# Altium project NixieClock_v010.PrjPcb
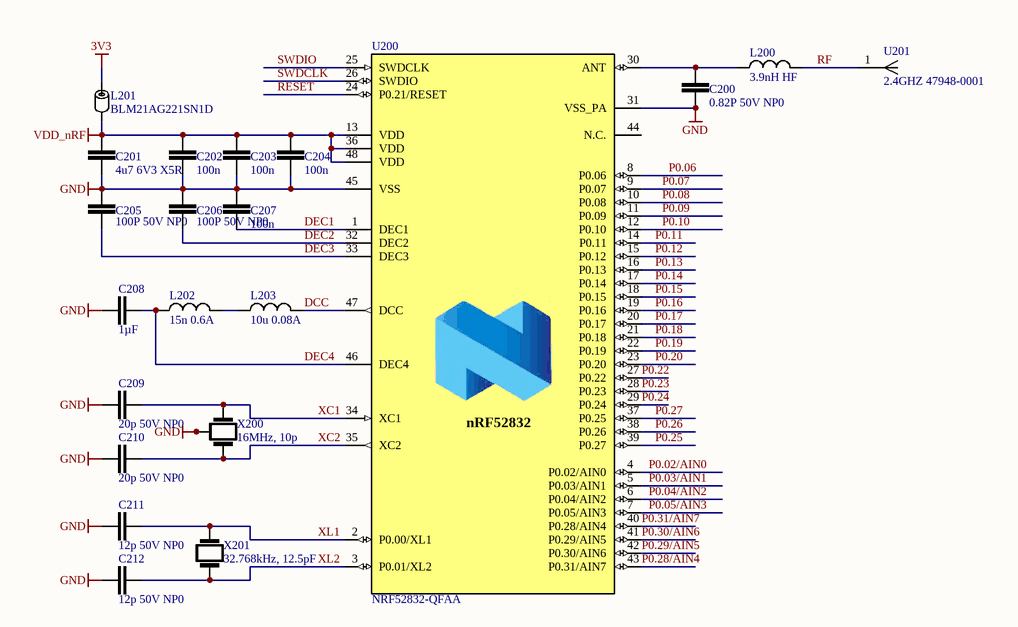
[diagram p0: MCU_nRF82532.SchDoc]
4 sheets, 83 parts. Net scope: hierarchical (ports join the sheet entries above them; power ports are global).
Sheets:
  MCU_nRF82532.SchDoc
  Misc.SchDoc
  Hierarchy.SchDoc
    Display Driver = DisplayDriver.SchDoc

## Sheet MCU_nRF82532.SchDoc
size A4

### Parts
C200  0.82P 50V NP0  [CAPC1608N]
C201  4u7 6V3 X5R  [CAPC2012N]
C202  100n  [CAPC2012N]
C203  100n  [CAPC2012N]
C204  100n  [CAPC2012N]
C205  100P 50V NP0  [CAPC2012N]
C206  100P 50V NP0  [CAPC2012N]
C207  100n  [CAPC2012N]
C208  1µF  [CAPC2012N]
C209  20p 50V NP0  [CAPC2012N]
C210  20p 50V NP0  [CAPC2012N]
C211  12p 50V NP0  [CAPC2012N]
C212  12p 50V NP0  [CAPC2012N]
L200  3.9nH HF  [INDC2009N]
L201  BLM21AG221SN1D  [INDC2009N]
L202  15n 0.6A  [INDP6060X32N]
L203  10u 0.08A  [INDC2009N]
U200  NRF52832-QFAA  [QFN40P600X600X90-48N]
U201  2.4GHZ 47948-0001  [RF_ANT_CHIP_2.4GHZ_47948-0001]
X200  16MHz, 10p  [SMD3225]
X201  32.768kHz, 12.5pF  [ABS06]

### Nets
3V3: L201.1
GND: C200.1 C201.1 C202.2 C203.2 C204.2 C205.2 C206.2 C207.2 C208.1 C209.1 C210.1 C211.2 C212.2 U200.31(VSS_PA) U200.45(VSS) X200.2(GND) X200.4(GND)
VDD_nRF: C201.2 C202.1 C203.1 C204.1 L201.2 U200.13(VDD) U200.36(VDD) U200.48(VDD)
DCC: L203.2 U200.47(DCC)
DEC1: C207.1 U200.1(DEC1)
DEC2: C206.1 U200.32(DEC2)
DEC3: C205.1 U200.33(DEC3)
DEC4: C208.2 L202.1 U200.46(DEC4)
P0.02/AIN0: U200.4(P0.02/AIN0)
P0.03/AIN1: U200.5(P0.03/AIN1)
P0.04/AIN2: U200.6(P0.04/AIN2)
P0.05/AIN3: U200.7(P0.05/AIN3)
P0.06: U200.8(P0.06)
P0.07: U200.9(P0.07)
P0.08: U200.10(P0.08)
P0.09: U200.11(P0.09)
P0.10: U200.12(P0.10)
P0.11: U200.14(P0.11)
P0.12: U200.15(P0.12)
P0.13: U200.16(P0.13)
P0.14: U200.17(P0.14)
P0.15: U200.18(P0.15)
P0.16: U200.19(P0.16)
P0.17: U200.20(P0.17)
P0.18: U200.21(P0.18)
P0.19: U200.22(P0.19)
P0.20: U200.23(P0.20)
P0.22: U200.27(P0.22)
P0.23: U200.28(P0.23)
P0.24: U200.29(P0.24)
P0.25: U200.39(P0.27)
P0.26: U200.38(P0.26)
P0.27: U200.37(P0.25)
P0.28/AIN4: U200.43(P0.31/AIN7)
P0.29/AIN5: U200.42(P0.30/AIN6)
P0.30/AIN6: U200.41(P0.29/AIN5)
P0.31/AIN7: U200.40(P0.28/AIN4)
RESET: U200.24(P0.21/RESET)
RF: L200.2 U201.1(FT)
SWDCLK: U200.26(SWDIO)
SWDIO: U200.25(SWDCLK)
XC1: C209.2 U200.34(XC1) X200.1
XC2: C210.2 U200.35(XC2) X200.3
XL1: C211.1 U200.2(P0.00/XL1) X201.2
XL2: C212.1 U200.3(P0.01/XL2) X201.1
NetC200_2: C200.2 L200.1 U200.30(ANT)
NetL202_2: L202.2 L203.1

Not connected (* = marked no-connect by the designer): U200 44(N.C.)

### Notes on the sheet
- (in symbol IC MCU nRF52832_QFAA ARM M0 BLUETOOTH) nRF52832

### Library data of the parts
C200 = CAP 1608 0.82P 50V 5% NP0: YAGEO (PHYCOMP) - CC0603CRNPO9BNR82 - CAP, MLCC, C0G/NP0, 0.82PF, 50V, 0603; Initial Voltage: 0; Supplier 1: Farnell; Supplier Part Number 1: 721839; Manufacturer Part Number: CC0603CRNPO9BNR82; Manufacturer: YAGEO (PHYCOMP); Value: 0.82P
C201 = CAP 2012 4U7F 6.3V 10% X5R: KEMET - C0805C475K9PACTU - CAP, MLCC, X5R, 4.7UF, 6.3V, 0805; Initial Voltage: 0; Capacitance Tolerance: ± 10%; Value: 4.7; Voltage Rating: 6.3; Package / Case: 0805 (2012 Metric); Supplier 1: Farnell; Supplier Part Number 1: 9227857; Manufacturer Part Number: C0805C475K9PACTU; Manufacturer: KEMET; Operating Temperature Range: -55°C to +85
C202-C204 C207 = CAP 2012 100N 25V 10% X7R: Ceramic Capacitor; Surface-Mount; Manufacturer: WALSIN; Manufacturer Part Number: 0805B104K250CT; Tolerance: ± 10%; Rating: 25V; Dielectric Characteristic: X7R; Initial Voltage: 0; Value: 100n; Supplier 1: Farnell; Supplier Part Number 1: 2496943
C205 C206 = CAP 2012 100P 50V 10% NP0: KEMET - C0805C101J5GACTU - CAP, MLCC, C0G/NP0, 100PF, 50V, 0805; Initial Voltage: 0; Package / Case: 0805 (2012 Metric); Supplier 1: Farnell; Supplier Part Number 1: 1414656; Manufacturer: KEMET; Manufacturer Part Number: C0805C101J5GACTU; Value: 100P
C208 = CAP 2012 1U 25V 10% X7R: CAP CER 1UF 25V X7R 0805; Manufacturer Part Number: GRM21BR71E105KA99L; Manufacturer: Murata Electronics North America; Initial Voltage: 0; Value: 1µF; Supplier 1: Digi-Key; Supplier Part Number 1: 490-6484-1-ND; Package / Case: 0805 (2012 Metric)
C209 C210 = CAP 2012 20P 50V 10% NP0: CAP CER 22PF 50V NP0 0805; Manufacturer Part Number: C0805C200J5GACTU; Manufacturer: KEMET; Initial Voltage: 0; Voltage Rating: 50; Dielectric Characteristic: C0G / NP0; Tolerance: 5%; Package / Case: 0805 (2012 Metric); Value: 20p; Supplier 1: Farnell; Supplier Part Number 1: 2581087
C211 C212 = CAP 2012 12P 50V 10% NP0: WALSIN - 0805N120J500CT - CAPACITOR, MLCC, NP0, 12PF, 50V, 0805; Initial Voltage: 0; Value: 22pF; Dielectric Characteristic: C0G / NP0; Package / Case: 0805 (2012 Metric); Supplier 1: Farnell; Supplier Part Number 1: 2497013; Manufacturer: WALSIN; Manufacturer Part Number: 0805N120J500CT
L200 = IND 2012 3.9N 5% HF: COILCRAFT - 0805HT-3N9TJLB - INDUCTOR, RF, 3.9NH, 5%, 6.1GHZ, SMD; Inductance: 3.9; High Frequency Inductor Case: 0805 [2012 Metric]; Self Resonant Frequency Min: 6.1; Supplier 1: Farnell; Supplier Part Number 1: 2286484; Inductance Tolerance: ± 5%; Manufacturer Part Number: 0805HT-3N9TJLB; Manufacturer: COILCRAFT
L201 = IND 2012 FERRITE 220R @ 100MHz: MURATA - BLM21AG221SN1D - FERRITE BEAD, 0.13OHM, 800MA, 0805; Initial Current: 0; DC Current Rating: 200; DC Resistance Max: 0.13; Ferrite Case Style: 0805 [2012 Metric]; Impedance @ 100MHz: 220; Manufacturer: MURATA; Supplier 1: Farnell; Operating Temperature Min: -55; Operating Temperature Max: +125; Manufacturer Part Number: BLM21AG221SN1D; Supplier Part Number 1: 1515619
L202 = IND 2012 15N 0.6A 5%: VISHAY - IMC0805ER15NJ01 - HF INDUCTOR, 15NH, 600MA, 5% 3.6GHZ; DC Resistance Max: 0.08; Inductance: 15; Tolerance: 5%; Value: 15n; Supplier 1: Farnell; Manufacturer Part Number: IMC0805ER15NJ01; Manufacturer: VISHAY; Supplier Part Number 1: 1189465
L203 = IND 2012 10U 0.08A 5%: ISHAY - IMC0805ER100J01 - INDUCTOR, WIREWOUND, HIGH F; Manufacturer: VISHAY; Tolerance: 5%; Value: 10u; Supplier 1: Farnell; Supplier Part Number 1: 1653752; Manufacturer Part Number: IMC0805ER100J01
U200 = IC MCU nRF52832_QFAA ARM M0 BLUETOOTH: Multi-protocol Bluetooth Low Energy, ANT and 2.4GHz proprietary system-on-chip; Part number IPS: N.A.; Manufacturer: Nordic Semiconductor ASA; Manufacturer Part Number: NRF52832-QFAA-R; Memory Size: 512kB Flash, 64kB RAM; Voltage - Supply: 1.7 V ~ 3.6 V; Pin Count: 54; Supplier 1: Digi-Key; Package / Case: 48-VFQFN Exposed Pad; Category: RF/IF and RFID; Operating Temperature: -40°C ~ 85°C; Frequency: 2.4GHz; Supplier Part Number 1: 1490-1052-6-ND
U201 = RF ANT CHIP 2.4GHZ 47948-0001
X200 = XTAL SMD 16MHz 10P 20ppm: ABRACON - ABM10-16.000MHZ-D30-T3 - CRYSTAL, 16MHZ, 10PF, 2.5 X 2MM; Crystal Case: SMD, 2.5mm x 2; Load Capacitance: 10; Frequency Nom: 16; Supplier 1: Farnell; Operating Temperature Max: 85; Manufacturer: ABRACON; Operating Temperature Min: -40; Manufacturer Part Number: ABM10-16.000MHZ-D30-T3; value: 16MHz; Supplier Part Number 1: 2467762
X201 = XTAL SMD 32.768K 12.5P 20PPM: ABRACON - ABS06-32.768KHZ-T - CRYSTAL, 32.768KHZ, 12.5PF, SMD; Crystal Case: SMD, 2mm x 1.2; Frequency: 32.768; Supplier 1: Farnell; Manufacturer Part Number: ABS06-32.768KHZ-T; Operating Temperature Range: -40°C to +85; Manufacturer: ABRACON; value: 32.768kHz, 12.5pF; Supplier Part Number 1: 2101345

## Sheet Misc.SchDoc
size A4
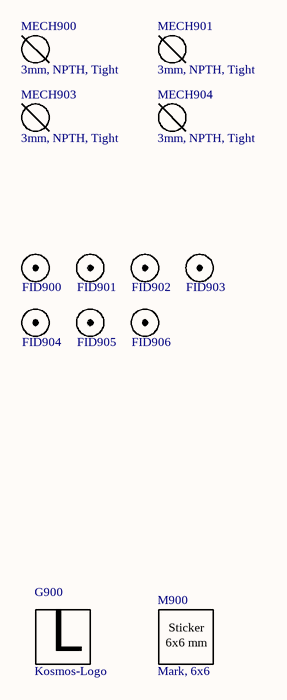
[diagram p1: Misc.SchDoc]

### Parts
FID900  FIDUCIAL ROUND 2,5MM  [FID100X300]  (value not drawn)  (no BOM)
FID901  FIDUCIAL ROUND 2,5MM  [FID100X300]  (value not drawn)  (no BOM)
FID902  FIDUCIAL ROUND 2,5MM  [FID100X300]  (value not drawn)  (no BOM)
FID903  FIDUCIAL ROUND 2,5MM  [FID100X300]  (value not drawn)  (no BOM)
FID904  FIDUCIAL ROUND 2,5MM  [FID100X300]  (value not drawn)  (no BOM)
FID905  FIDUCIAL ROUND 2,5MM  [FID100X300]  (value not drawn)  (no BOM)
FID906  FIDUCIAL ROUND 2,5MM  [FID100X300]  (value not drawn)  (no BOM)
G900  Kosmos-Logo  [KOSMOS_LOGO_S]  (no BOM)
M900  Mark, 6x6  [MARK_6X6_A]  (no BOM)
MECH900  3mm, NPTH, Tight  [MTGNP730H310P]  (no BOM)
MECH901  3mm, NPTH, Tight  [MTGNP730H310P]  (no BOM)
MECH903  3mm, NPTH, Tight  [MTGNP730H310P]  (no BOM)
MECH904  3mm, NPTH, Tight  [MTGNP730H310P]  (no BOM)

### Notes on the sheet
- (in symbol LOGO KOSMOS OVERLAY) L
- (in symbol STICKER MARK 6X6) Sticker; 6x6 mm

### Library data of the parts
FID900-FID906 = FIDUCIAL ROUND 2,5MM: Fiducial, Round, 1mm
G900 = LOGO KOSMOS OVERLAY: Kosmos-Logo-XL-Top-Overlay
M900 = STICKER MARK 6X6: Stick Mark, 6x6 mm,
MECH900 MECH901 MECH903 MECH904 = MH 3MM NPTH TIGHT: Mounting Hole, 3mm, Non-Plated, Tight-Fit

## Sheet Hierarchy.SchDoc
size A4
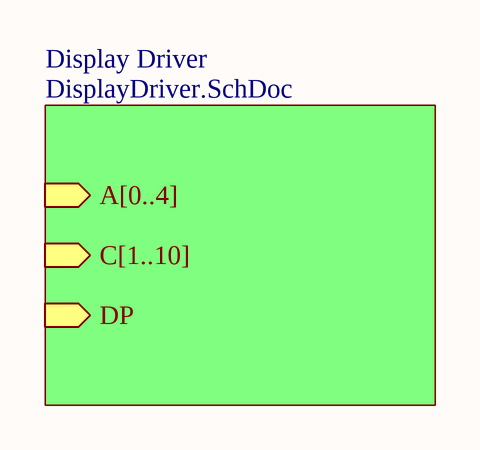
[diagram p2: Hierarchy.SchDoc]

### Sub-sheets
Display Driver = DisplayDriver.SchDoc: A[0..4] (in), C[1..10] (in), DP (in)

## Sheet DisplayDriver.SchDoc
size A4
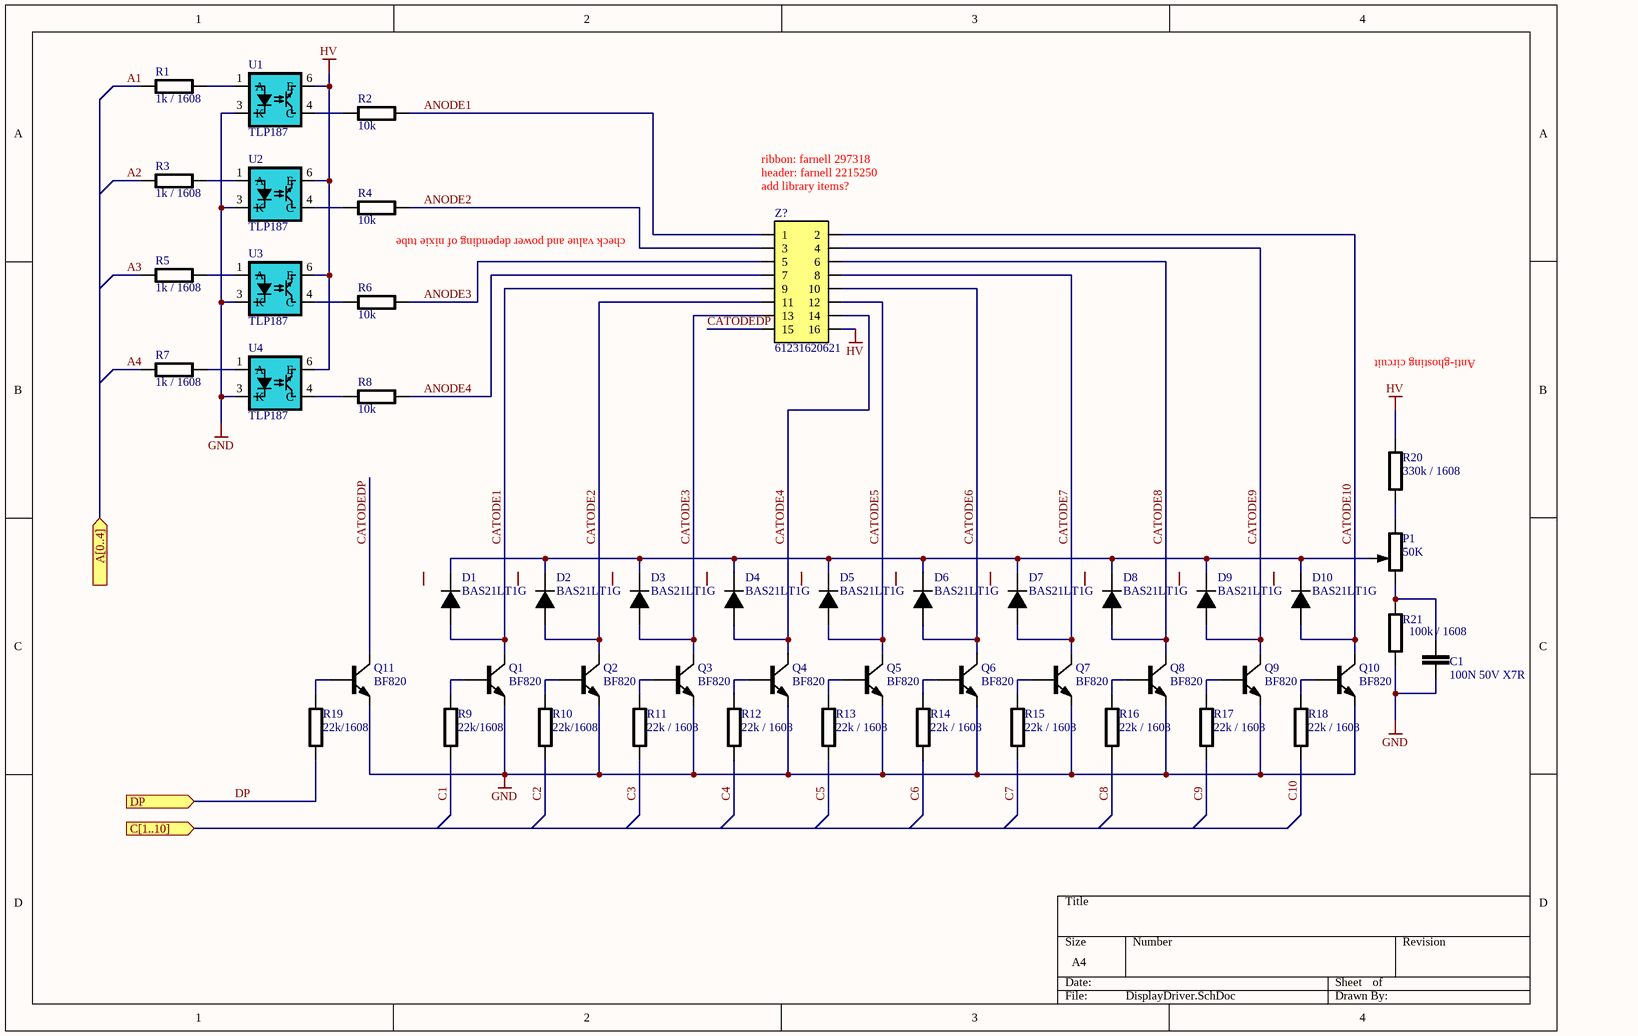
[diagram p3: DisplayDriver.SchDoc]

### Parts
C1  100N 50V X7R  [CAPC1608N]
D1  BAS21LT1G  [SOT95P230X124-3N]
D2  BAS21LT1G  [SOT95P230X124-3N]
D3  BAS21LT1G  [SOT95P230X124-3N]
D4  BAS21LT1G  [SOT95P230X124-3N]
D5  BAS21LT1G  [SOT95P230X124-3N]
D6  BAS21LT1G  [SOT95P230X124-3N]
D7  BAS21LT1G  [SOT95P230X124-3N]
D8  BAS21LT1G  [SOT95P230X124-3N]
D9  BAS21LT1G  [SOT95P230X124-3N]
D10  BAS21LT1G  [SOT95P230X124-3N]
P1  50K  [TRIM_3314J_BOURNS]
Q1  BF820  [SOT95P230X124-3N]
Q2  BF820  [SOT95P230X124-3N]
Q3  BF820  [SOT95P230X124-3N]
Q4  BF820  [SOT95P230X124-3N]
Q5  BF820  [SOT95P230X124-3N]
Q6  BF820  [SOT95P230X124-3N]
Q7  BF820  [SOT95P230X124-3N]
Q8  BF820  [SOT95P230X124-3N]
Q9  BF820  [SOT95P230X124-3N]
Q10  BF820  [SOT95P230X124-3N]
Q11  BF820  [SOT95P230X124-3N]
R1  1k / 1608  [RESC1608N]
R2  10k  [RESC2012N]
R3  1k / 1608  [RESC1608N]
R4  10k  [RESC2012N]
R5  1k / 1608  [RESC1608N]
R6  10k  [RESC2012N]
R7  1k / 1608  [RESC1608N]
R8  10k  [RESC2012N]
R9  22k/1608  [RESC1608N]
R10  22k/1608  [RESC1608N]
R11  22k / 1608  [RESC1608N]
R12  22k / 1608  [RESC1608N]
R13  22k / 1608  [RESC1608N]
R14  22k / 1608  [RESC1608N]
R15  22k / 1608  [RESC1608N]
R16  22k / 1608  [RESC1608N]
R17  22k / 1608  [RESC1608N]
R18  22k / 1608  [RESC1608N]
R19  22k/1608  [RESC1608N]
R20  330k / 1608  [RESC1608N]
R21  100k / 1608  [RESC1608N]
U1  TLP187  [SOP127P700X220-4_6N]
U2  TLP187  [SOP127P700X220-4_6N]
U3  TLP187  [SOP127P700X220-4_6N]
U4  TLP187  [SOP127P700X220-4_6N]
Z?  61231620621  [WE_61231620621]

### Ports
A[0..4] (in), C[1..10] (in), DP (in)

### Nets
GND: C1.2 Q1.2(E) Q2.2(E) Q3.2(E) Q4.2(E) Q5.2(E) Q6.2(E) Q7.2(E) Q8.2(E) Q9.2(E) Q10.2(E) Q11.2(E) R21.1 U1.3(K) U2.3(K) U3.3(K) U4.3(K)
HV: R20.1 U1.6(E) U2.6(E) U3.6(E) U4.6(E) Z?.16
A1: R1.1
A2: R3.1
A3: R5.2
A4: R7.1
ANODE1: R2.1 Z?.1
ANODE2: R4.1 Z?.3
ANODE3: R6.1 Z?.5
ANODE4: R8.1 Z?.7
C1: R9.2
C2: R10.1
C3: R11.2
C4: R12.2
C5: R13.2
C6: R14.1
C7: R15.2
C8: R16.2
C9: R17.2
C10: R18.1
CATODE1: D1.1(A) Q1.3(C) Z?.9
CATODE2: D2.1(A) Q2.3(C) Z?.11
CATODE3: D3.1(A) Q3.3(C) Z?.13
CATODE4: D4.1(A) Q4.3(C) Z?.14
CATODE5: D5.1(A) Q5.3(C) Z?.12
CATODE6: D6.1(A) Q6.3(C) Z?.10
CATODE7: D7.1(A) Q7.3(C) Z?.8
CATODE8: D8.1(A) Q8.3(C) Z?.6
CATODE9: D9.1(A) Q9.3(C) Z?.4
CATODE10: D10.1(A) Q10.3(C) Z?.2
CATODEDP: Q11.3(C) Z?.15
DP: R19.1 ; port DP
NetC1_1: C1.1 P1.1 R21.2
NetD1_3: D1.3(K) D2.3(K) D3.3(K) D4.3(K) D5.3(K) D6.3(K) D7.3(K) D8.3(K) D9.3(K) D10.3(K) P1.2
NetP1_3: P1.3 R20.2
NetQ1_1: Q1.1(B) R9.1
NetQ2_1: Q2.1(B) R10.2
NetQ3_1: Q3.1(B) R11.1
NetQ4_1: Q4.1(B) R12.1
NetQ5_1: Q5.1(B) R13.1
NetQ6_1: Q6.1(B) R14.2
NetQ7_1: Q7.1(B) R15.1
NetQ8_1: Q8.1(B) R16.1
NetQ9_1: Q9.1(B) R17.1
NetQ10_1: Q10.1(B) R18.2
NetQ11_1: Q11.1(B) R19.2
NetR1_2: R1.2 U1.1(A)
NetR2_2: R2.2 U1.4(C)
NetR3_2: R3.2 U2.1(A)
NetR4_2: R4.2 U2.4(C)
NetR5_1: R5.1 U3.1(A)
NetR6_2: R6.2 U3.4(C)
NetR7_2: R7.2 U4.1(A)
NetR8_2: R8.2 U4.4(C)

### Notes on the sheet
- ribbon: farnell 297318
- header: farnell 2215250
- (near R4) check value and power depending of nixie tube
- (near Z?) add library items?
- Anti-ghosting circuit

### Library data of the parts
C1 = CAP 1608 100N 50V 10% X7R: WALSIN - 0603B104K500CT - CAPACITOR, MLCC, X7R, 0.1UF, 50V, 0603; Initial Voltage: 0; Dielectric Characteristic: X7; Value: 100n; Supplier 1: Farnell; Supplier Part Number 1: 2496834; Manufacturer Part Number: 0603B104K500CT; Manufacturer: WALSIN
D1-D10 = DIODE BAS21LT1G 250V 200MA SOT23-3: DIODE BAS21LT1G GEN PURP 250V 200MA SOT23; Manufacturer: ON Semiconductor; Package / Case: TO-236-3, SC-59, SOT-23-3; Manufacturer Part Number: BAS21LT1G; Supplier 1: Farnell; Supplier Part Number 1: 2394287
P1 = POT TRIM 50K 20% 3314 Series: BOURNS - 3314J-2-503E - TRIMMER, POT, 50KOHM, 20%, 1TURN, SMD; Manufacturer: BOURNS; Supplier 1: Farnell; Supplier Part Number 1: 2328519; Manufacturer Part Number: 3314J-2-503E; Value: 50k
Q1-Q11 = NPN BF820 300V 0.05A SOT23-3: NEXPERIA - BF820 - TRANSISTOR, NPN, SOT-23; Package / Case: TO-236-3, SC-59, SOT-23-3; Supplier 1: Farnell; Supplier Part Number 1: 1081284; Manufacturer Part Number: BF820; Manufacturer: NEXPERIA
R1 R3 R5 R7 = RES 1608 1K 1%: VISHAY - CRCW06031K00FKEA - RES, THICK FILM, 1K, 1%, 0.1W, 0603; Tolerance: ±1%; Value: 1k; Manufacturer: VISHAY; Supplier 1: Farnell; Supplier Part Number 1: 1469740; Manufacturer Part Number: CRCW06031K00FKEA
R2 R4 R6 R8 = RES 2012 10K 1%: RES SMD 10K OHM 1% 1/8W 0805; Manufacturer: Vishay Dale; Manufacturer Part Number: CRCW080510K0FKEA; Supplier 1: Farnell; Supplier Part Number 1: 1469856; Tolerance: ±1%; Value: 10k
R9-R19 = RES 1608 22K 1%: VISHAY - CRCW060322K0FKEA - RES, THICK FILM, 22K, 1%, 0.1W, 0603; Tolerance: ±1%; Value: 22k; Manufacturer: VISHAY; Supplier 1: Farnell; Supplier Part Number 1: 1469779; Manufacturer Part Number: CRCW060322K0FKEA
R20 = RES 1608 330K 1%: VISHAY - CRCW0603330KFKEA. - RES, THICK FILM, 330K, 1%, 0.1W, 0603; Tolerance: ±1%; Operating Temperature Range: -55°C to +155; Supplier 1: Farnell; Supplier Part Number 1: 2138547; Manufacturer Part Number: CRCW0603330KFKEA.; Manufacturer: VISHAY; Value: 330k
R21 = RES 1608 100K 1%: VISHAY - CRCW0603100KFKEA. - RES, THICK FILM, 100K, 1%, 0.1W, 0603; Supplier 1: Farnell; Supplier Part Number 1: 1469649; Manufacturer Part Number: CRCW0603100KFKEA.; Manufacturer: VISHAY; Value: 100k
U1-U4 = IC OPTOCOUPLER TLP187: TOSHIBA - TLP187 - OPTOCOUPLER, DARLINGTON, 3.75KV, SMDIP-4; Revision: 17-Jul-2002: Re-released for DXP Platform.; Supplier 1: Farnell; Supplier Part Number 1: 2524263; Manufacturer: TOSHIBA; Manufacturer Part Number: TLP187
Z? = HEADER 61231620621 2X8 2.54MM: WURTH ELEKTRONIK - 61231620621 - HEADER, 2.54MM, MALE, SMT, R/A, 16WAY; Supplier 1: Farnell; Supplier Part Number 1: 2356282; Manufacturer: WURTH ELEKTRONIK; Manufacturer Part Number: 61231620621

## Nets that join several sheets
GND: MCU_nRF82532 (17 pins), DisplayDriver (17 pins)